# Altium schematic sheet Austin_A2.SchDoc
size A2; Organization: Altium Limited; Address1: L3, 12a Rodborough Rd; Address2: Frenchs Forest; Address3: NSW; Address4: Australia 2086
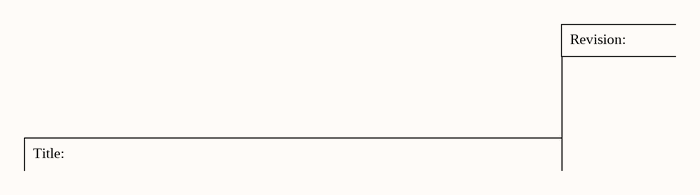
[diagram p0: Austin_A2.SchDoc]

## Notes on the sheet
- Revision:
- Title: